# EAGLE design NeoDigito Small v2_1 PCBWay (EAGLE 9.6.2)
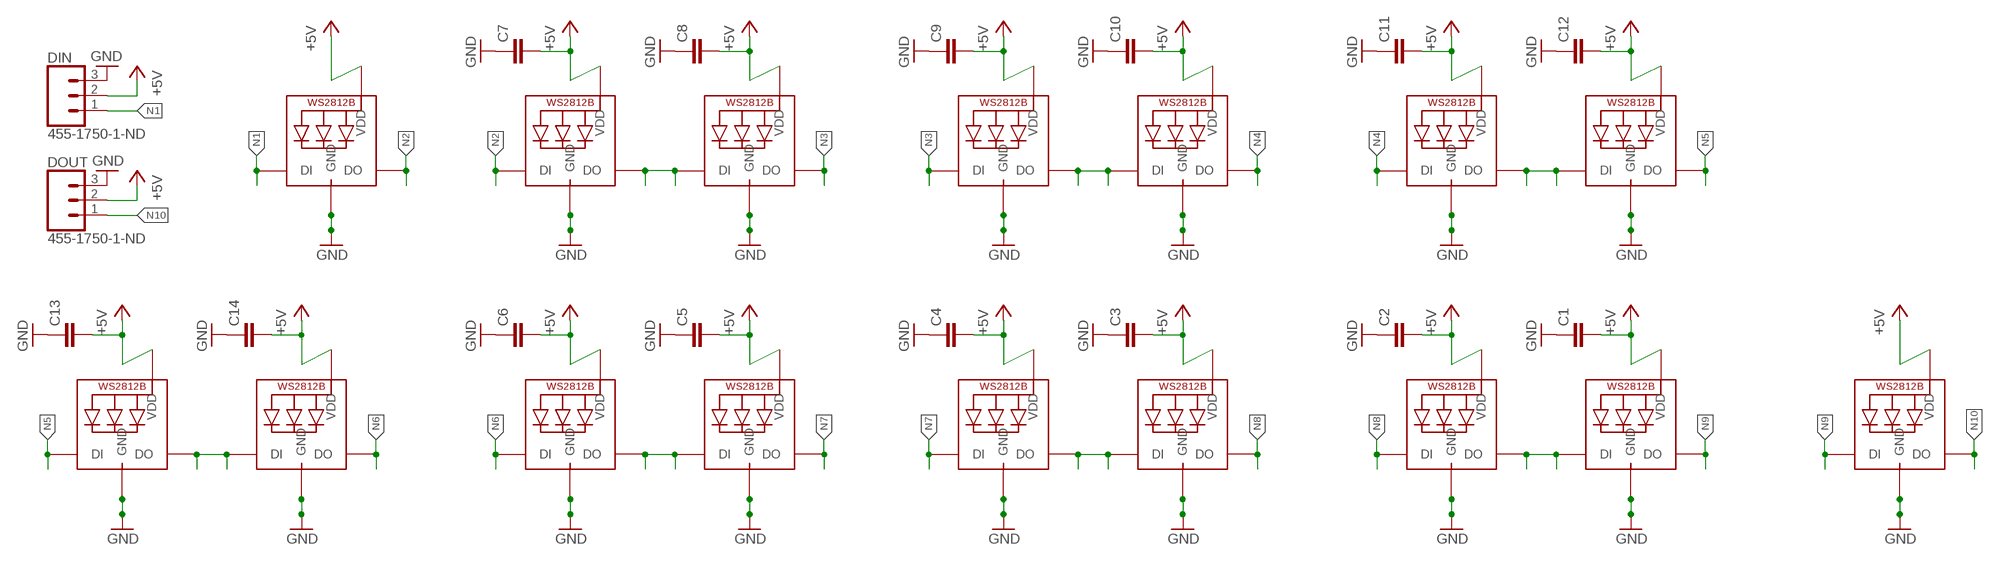
[diagram p0: schematic, sheet 1]

## Parts
C1  C-EUC0805  [C0805]
C2  C-EUC0805  [C0805]
C3  C-EUC0805  [C0805]
C4  C-EUC0805  [C0805]
C5  C-EUC0805  [C0805]
C6  C-EUC0805  [C0805]
C7  C-EUC0805  [C0805]
C8  C-EUC0805  [C0805]
C9  C-EUC0805  [C0805]
C10  C-EUC0805  [C0805]
C11  C-EUC0805  [C0805]
C12  C-EUC0805  [C0805]
C13  C-EUC0805  [C0805]
C14  C-EUC0805  [C0805]
DIN  455-1750-1-ND  CONN_03  [1X03]
DOUT  455-1750-1-ND  CONN_031X03_NO_SILK  [1X03_NO_SILK]
PA.  WS2812B3535  [LED3535]
PB.  WS2812B3535  [LED3535]
SA1.  WS2812B3535  [LED3535]
SA2.  WS2812B3535  [LED3535]
SB1.  WS2812B3535  [LED3535]
SB2.  WS2812B3535  [LED3535]
SC1.  WS2812B3535  [LED3535]
SC2.  WS2812B3535  [LED3535]
SD1.  WS2812B3535  [LED3535]
SD2.  WS2812B3535  [LED3535]
SE1.  WS2812B3535  [LED3535]
SE2.  WS2812B3535  [LED3535]
SF1.  WS2812B3535  [LED3535]
SF2.  WS2812B3535  [LED3535]
SG1.  WS2812B3535  [LED3535]
SG2.  WS2812B3535  [LED3535]

## Nets
+5V: C1.2 C2.2 C3.2 C4.2 C5.2 C6.2 C7.2 C8.2 C9.2 C10.2 C11.2 C12.2 C13.2 C14.2 DIN.2 DOUT.2 PA..2(VDD) PB..2(VDD) SA1..2(VDD) SA2..2(VDD) SB1..2(VDD) SB2..2(VDD) SC1..2(VDD) SC2..2(VDD) SD1..2(VDD) SD2..2(VDD) SE1..2(VDD) SE2..2(VDD) SF1..2(VDD) SF2..2(VDD) SG1..2(VDD) SG2..2(VDD)
GND: C1.1 C2.1 C3.1 C4.1 C5.1 C6.1 C7.1 C8.1 C9.1 C10.1 C11.1 C12.1 C13.1 C14.1 DIN.3 DOUT.3 PA..4(GND) PB..4(GND) SA1..4(GND) SA2..4(GND) SB1..4(GND) SB2..4(GND) SC1..4(GND) SC2..4(GND) SD1..4(GND) SD2..4(GND) SE1..4(GND) SE2..4(GND) SF1..4(GND) SF2..4(GND) SG1..4(GND) SG2..4(GND)
N1: DIN.1 PB..1(DI)
N2: PB..3(DO) SC1..1(DI)
N3: SC2..3(DO) SD1..1(DI)
N4: SD2..3(DO) SE1..1(DI)
N5: SE2..3(DO) SG1..1(DI)
N6: SB1..1(DI) SG2..3(DO)
N7: SA1..1(DI) SB2..3(DO)
N8: SA2..3(DO) SF1..1(DI)
N9: PA..1(DI) SF2..3(DO)
N10: DOUT.1 PA..3(DO)
N$1: SE1..3(DO) SE2..1(DI)
N$2: SC1..3(DO) SC2..1(DI)
N$3: SA1..3(DO) SA2..1(DI)
N$4: SF1..3(DO) SF2..1(DI)
N$5: SD1..3(DO) SD2..1(DI)
N$14: SG1..3(DO) SG2..1(DI)
N$17: SB1..3(DO) SB2..1(DI)

## Library data of the parts
C1-C14 = CCV1:C-EU: CAPACITOR, European symbol; SPICEPREFIX: C
DIN = CCV1:CONN_03: Multi connection point. Often used as Generic Header-pin footprint for 0.1 inch spaced/style header connections On any of the 0.1 inch spaced packages, you can populate with these: Break Away Headers - Straight <https://www.sparkfun.com/products/116> (PRT-00116) Break Away Male Headers - Right Angle <https://www.sparkfun.com/products/553> (PRT-00553) Female Headers <https://www.sparkfun.com/products/115> (PRT-00115) Break Away Headers - Machine Pin <https://www.sparkfun.com/products/117> (PRT-00117) Break Away Female Headers - Swiss Machine Pin <https://www.sparkfun.com/products/743> (PRT-00743) Stackable Header - 3 Pin (Female, 0.1") <https://www.sparkfun.com/products/13875> (PRT-13875) For SCREWTERMINALS and SPRING TERMINALS visit here: Screw Terimnals on SparkFun.com <https://www.sparkfun.com/search/results?term=Screw+Terminals> (5mm/3.5mm/2.54mm spacing) This device is also useful as a general connection point to wire up your design to another part of your project. Our various solder wires solder well into these plated through hole pads. Hook-Up Wire - Assortment (Stranded, 22 AWG) <https://www.sparkfun.com/products/11375> (PRT-11375) Hook-Up Wire - Assortment (Solid Core, 22 AWG) <https://www.sparkfun.com/products/11367> (PRT-11367) View the entire wire category on our website here <https://www.sparkfun.com/categories/141> Special notes: Molex polarized connector foot print use with SKU : PRT-08232 with associated crimp pins and housings.; PROD_ID: XXX-00000
DOUT = CCV1:CONN_03: Multi connection point. Often used as Generic Header-pin footprint for 0.1 inch spaced/style header connections On any of the 0.1 inch spaced packages, you can populate with these: Break Away Headers - Straight <https://www.sparkfun.com/products/116> (PRT-00116) Break Away Male Headers - Right Angle <https://www.sparkfun.com/products/553> (PRT-00553) Female Headers <https://www.sparkfun.com/products/115> (PRT-00115) Break Away Headers - Machine Pin <https://www.sparkfun.com/products/117> (PRT-00117) Break Away Female Headers - Swiss Machine Pin <https://www.sparkfun.com/products/743> (PRT-00743) Stackable Header - 3 Pin (Female, 0.1") <https://www.sparkfun.com/products/13875> (PRT-13875) For SCREWTERMINALS and SPRING TERMINALS visit here: Screw Terimnals on SparkFun.com <https://www.sparkfun.com/search/results?term=Screw+Terminals> (5mm/3.5mm/2.54mm spacing) This device is also useful as a general connection point to wire up your design to another part of your project. Our various solder wires solder well into these plated through hole pads. Hook-Up Wire - Assortment (Stranded, 22 AWG) <https://www.sparkfun.com/products/11375> (PRT-11375) Hook-Up Wire - Assortment (Solid Core, 22 AWG) <https://www.sparkfun.com/products/11367> (PRT-11367) View the entire wire category on our website here <https://www.sparkfun.com/categories/141> Special notes: Molex polarized connector foot print use with SKU : PRT-08232 with associated crimp pins and housings.
PA. PB. SA1. SA2. SB1. SB2. SC1. SC2. SD1. SD2. SE1. SE2. SF1. SF2. SG1. SG2. = adafruit:WS2812B

## Board
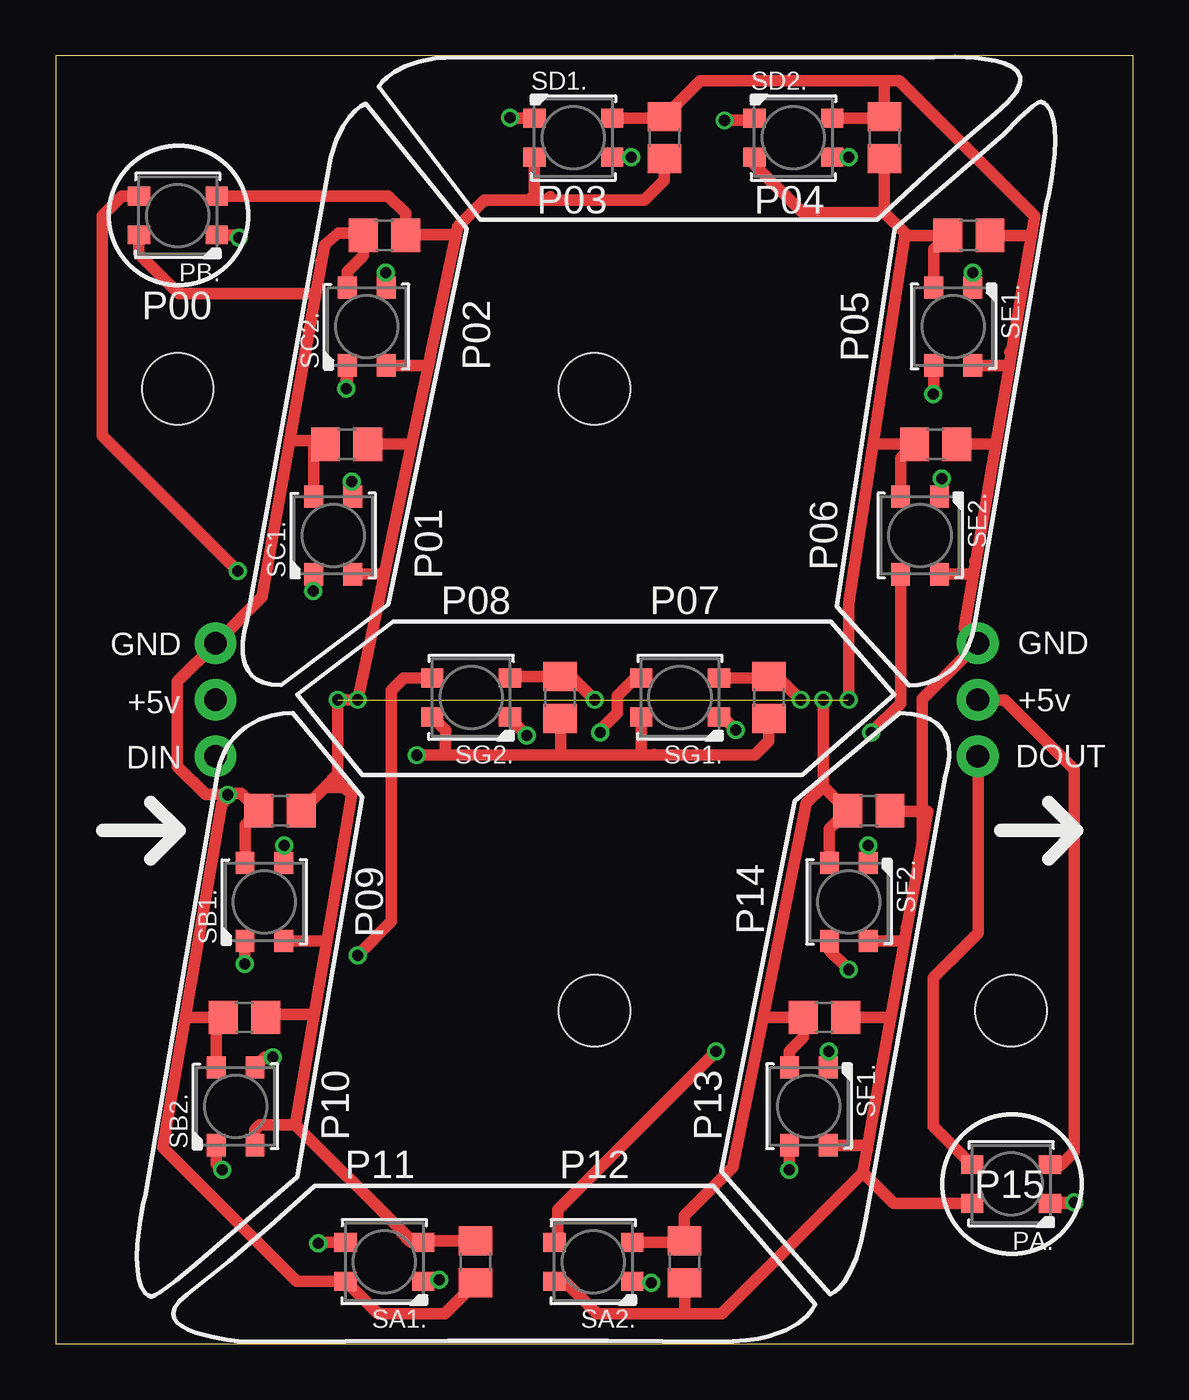
[diagram p1: board, top side]
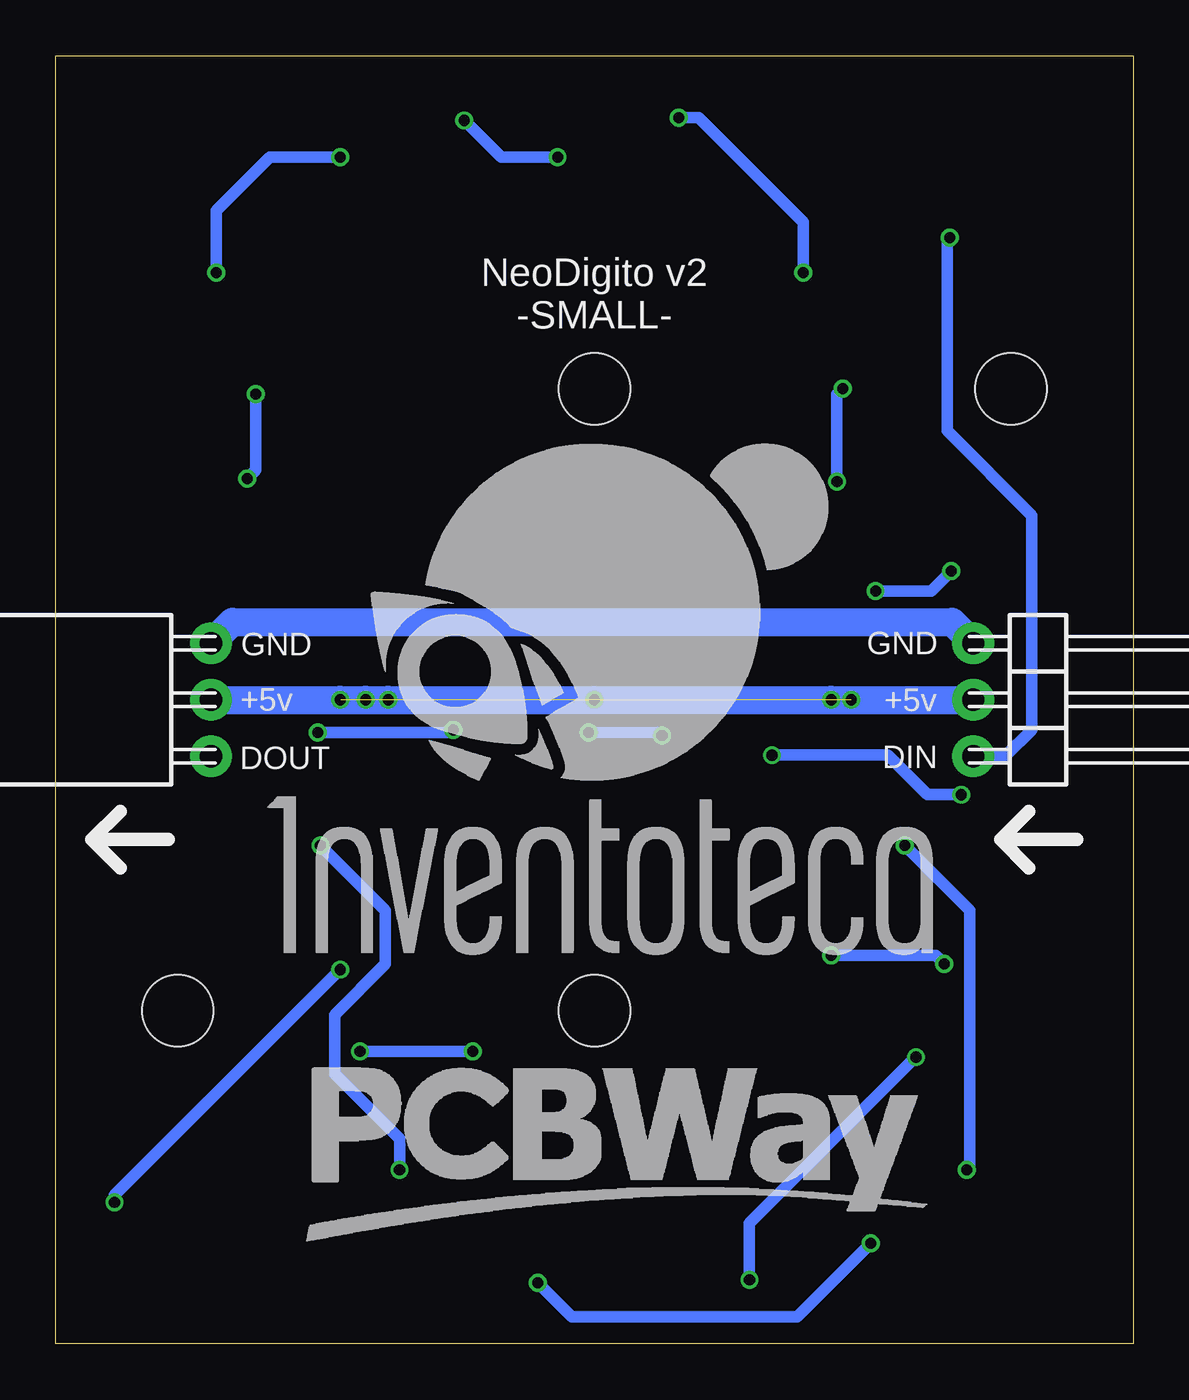
[diagram p2: board, bottom side, seen from below]

Size 48.5 x 58 mm. Coordinates in mm from the lower left corner, seen from the top.
Outline: 48.5,58 0,58 0,0 48.5,0 48.5,58
Copper layers (1*16): Top 0.035mm / dielectric 1.5mm / Bottom 0.035mm
Design rules "_xircuitos.mx_2L_DRC": minimum track width 6mil, minimum drill 12mil, track to track 6mil, track to pad 6mil, pad to pad 6mil, via to via 6mil, smd to smd 0mil, copper to edge 10mil, drill to drill 12mil, minimum pad ring 10mil, minimum via ring 6mil, stop-mask expansion 2mil, vias tented up to drill 100mil, thermal gap 10mil
Holes 3.2 mm at 24.25,43 24.25,15 43,15 5.5,43

### Footprints (pad centres in the part's own frame; a part is rotated, then mirrored left to right if it is on the bottom)
C0805 = smd 1.3 x 1.5: 1 -0.95,0; 2 0.95,0
1X03 = drill 1 pad 1.88: 1 -2.54,0; 2 0,0; 3 2.54,0
1X03_NO_SILK = drill 1.016 pad 1.88: 1 -2.54,0; 2 0,0; 3 2.54,0
LED3535 = smd 1 x 0.85: 1 -1.75,0.875; 2 -1.75,-0.875; 3 1.75,-0.875; 4 1.75,0.875

### Placement (x,y rotation side)
C1  36.6,24 180 top
C2  34.6,14.7 180 top
C3  28.3,3.7 90 top
C4  18.9,3.7 90 top
C5  8.5,14.7 0 top
C6  10.1,24 0 top
C7  13.1,40.5 0 top
C8  14.8,49.9 0 top
C9  27.4,54.3 270 top
C10  37.3,54.3 270 top
C11  41.1,49.9 180 top
C12  39.6,40.5 180 top
C13  32.1,29.1 90 top
C14  22.7,29.1 90 top
DIN  7.2,29 90 bottom
DOUT  41.5,29 90 bottom
PA.  43,7.2 180 top
PB.  5.5,50.8 180 top
SA1.  14.8,3.7 180 top
SA2.  24.2,3.7 180 top
SB1.  9.4,19.9 90 top
SB2.  8.1,10.7 90 top
SC1.  12.5,36.4 90 top
SC2.  14,45.8 90 top
SD1.  23.3,54.3 0 top
SD2.  33.2,54.3 0 top
SE1.  40.4,45.8 270 top
SE2.  38.9,36.4 270 top
SF1.  33.9,10.7 270 top
SF2.  35.7,19.9 270 top
SG1.  28.1,29.1 180 top
SG2.  18.7,29.1 180 top

### Tracks (layer width: path | path; a pad name or v marks a point on that pad's centre or on a via)
+5V  (via drill 0.5)  (1 unrouted)
  Top 0.508: 17.98,49.75 18.1,50.3 19.3,51.5 21.3,51.5 | 17.98,49.75 16.92,44.7 16.77,43.99 | 16.77,43.99 16.02,40.43 | 16.02,40.43 14.95,35.41 14.79,34.62 | 14.79,34.62 v13.6,29 v12.7,29 12.7,25.65 | C7.2 15.95,40.5 16.02,40.43 | 17.98,49.75 17.98,49.9 18.02,49.94 15.79,49.94 C8.2 15.75,50.9 14.97,51.67 PB..2 | C9.2 27.4,52.4 26.5,51.5 22.1,51.5 | 21.3,51.5 22.1,51.5 | 22.25,51.65 22.1,51.5 | 36.77,40.43 35.69,33.36 v35.69,29 | 36.77,40.43 38.23,50 | 38.23,50 37.3,50.93 | 37.3,50.93 C10.2 | 37.3,50.93 33.62,50.93 31.45,53.09 SD2..2 | 38.23,50 38.33,49.9 C11.2 39.52,49.27 SE1..2 | 36.77,40.43 36.84,40.5 C12.2 38.02,39.88 SE2..2 | v33.53,29 32.48,30.05 C13.2 32.02,29.98 SG1..2 | v24.26,29 23.21,30.05 C14.2 20.7,30.05 20.62,29.98 SG2..2 | v34.55,29 34.55,25.11 | 34.55,25.11 33.78,24.34 31.82,14.6 | 31.82,14.6 30.48,7.96 28.3,5.78 C3.2 28.23,4.58 SA2..2 | 15.93,4.65 C4.2 | 12.7,25.65 12.7,25.36 13,25.06 | 13,25.06 13.34,24.73 12.36,19 12.2,18.1 | 12.2,18.1 11.64,14.83 | 11.64,14.83 10.8,9.87 | 10.8,9.87 15.53,5.13 | 15.53,5.13 15.85,4.81 | 10.8,9.87 9.19,9.87 8.97,9.65 SB2..2 | C5.2 9.58,14.83 11.64,14.83 | C6.2 12.11,25.06 | 12.11,25.06 12.7,25.65 | 13,25.06 12.11,25.06 | 31.82,14.6 31.92,14.7 C2.2 33.66,13.8 33.02,13.17 SF1..2 | 34.55,25.11 34.55,25.1 C1.2 34.83,23.18 SF2..2 | DOUT.2 42.72,29 45.85,25.87 45.85,8.66 45.26,8.07 PA..2 | SC1..2 14.76,34.65 14.79,34.62 | SC2..2 16.7,44.05 16.77,43.99 | SD1..2 21.55,51.75 21.3,51.5 | SB1..2 12.15,18.15 12.2,18.1 | SA1..2 16,4.58 15.93,4.65 | 15.53,5.13 15.53,5.04 15.93,4.65
  Bottom 0.508: 34.42,29 v34.55,29
  Bottom 1.27: DOUT.2 v35.69,29 v34.55,29 v33.53,29 v24.26,29 v13.6,29 DIN.2
GND  (via drill 0.5)
  Top 0.508: 11.62,39.98 C7.1 11.99,40.66 11.5,40.66 | 10.54,40.66 9.3,33.7 9.3,33.64 DIN.3 5.48,29.82 5.48,26 6.75,24.73 v7.75,24.73 7.88,24.73 | 10.54,40.66 11.71,47.28 | 11.93,48.49 12.11,49.48 12.73,50 13.75,50 C8.1 13.85,49 13.12,48.27 SC2..4 | 11.71,47.28 5.55,47.28 3.75,49.08 PB..4 | 11.93,48.74 11.93,48.49 | 11.5,40.66 10.54,40.66 | 41.3,34.58 40.9,32.22 DOUT.3 38.99,29.03 38.99,22.55 | 41.3,34.58 41.41,35.2 | 41.41,35.2 42.31,40.47 | 42.31,40.47 42.91,43.98 | 42.91,43.98 43.01,44.57 | 43.01,44.57 43.92,49.85 | 43.92,49.85 44.07,50.76 37.98,56.86 37.47,56.86 | 37.47,56.86 29.01,56.86 C9.1 27.32,55.17 SD1..4 | 37.47,56.86 37.3,56.69 C10.1 37.23,55.17 SD2..4 | C11.1 43.87,49.9 43.92,49.85 | 42.93,44.65 43.01,44.57 | C12.1 42.28,40.5 42.31,40.47 | 41.36,35.25 41.41,35.2 | 26.93,26.5 31.47,26.5 32.1,27.13 C13.1 | 26.93,26.5 26.3,26.5 | 26.3,26.5 22.73,26.5 | 22.73,26.5 17.66,26.5 | C14.1 22.73,28.11 22.73,26.5 | 26.95,26.53 26.93,26.5 | 7.88,24.73 7.47,24.32 5.83,14.7 | 5.83,14.7 4.83,8.85 10.85,2.83 SA1..4 14.52,1.36 17.51,1.36 C4.1 | 38.99,22.55 38.3,18.72 | 38.3,18.72 38.21,18.18 | 38.21,18.18 37.56,14.57 | 37.56,14.57 36.64,9.47 36.56,9.04 | 36.56,9.04 36.32,7.71 | 36.32,7.71 29.97,1.36 28.32,1.36 | 28.32,1.36 24.39,1.36 22.92,2.83 SA2..4 | C3.1 28.32,2.73 28.32,1.36 | C1.1 37.59,23.96 39.24,23.96 38.99,22.55 | C2.1 37.43,14.7 37.56,14.57 | 38.27,18.75 38.3,18.72 | 5.83,14.7 C5.1 7.22,14.38 SB2..4 | 17.66,26.5 v16.26,26.5 | 17.66,26.5 17.53,26.63 17.53,27.14 17.55,27.16 17.55,27.62 SG2..4 | 7.88,24.73 7.94,24.79 8.36,24.79 C6.1 8.53,23.38 SB1..4 | SC1..4 11.62,40.53 11.5,40.66 | SE2..4 41.23,34.65 41.3,34.58 | SE1..4 42.84,44.05 42.91,43.98
  Top 0.508: SG1..4 26.35,26.55 26.3,26.5 | SF1..4 36.47,8.95 36.56,9.04 | SF2..4 38.17,18.15 38.21,18.18 | PA..4 37.72,6.33 36.33,7.71 36.32,7.71 | 11.71,47.28 11.93,48.49
  Bottom 0.508: v16.26,26.5 11.05,26.5 9.27,24.73 v7.75,24.73
  Bottom 1.27: DOUT.3 40.54,32.5 8.16,32.5 DIN.3
N1  (via drill 0.5)
  Top 0.508: v8.26,49.81 8.14,49.92 PB..1
  Bottom 0.508: DIN.1 5.76,26.46 4.57,27.65 4.57,37.3 8.38,41.11 8.38,49.68 v8.26,49.81
N2  (via drill 0.5)
  Top 0.508: v8.2,34.8 2.1,40.9 2.1,50.8 2.98,51.67 PB..3 | 11.6,34.88 v11.6,33.9 11.6,34.62 SC1..1
  Bottom 0.508: v8.2,34.8 9.1,33.9 v11.6,33.9
N3  (via drill 0.5)
  Top 0.508: v14.86,48.22 14.88,48.21 SC2..3 | SD1..1 20.48,55.17 v20.45,55.21
  Bottom 0.508: v14.86,48.22 14.86,50.51 19.56,55.21 v20.45,55.21
N4  (via drill 0.5)
  Top 0.508: v41.28,48.22 v41.27,48.22 SE1..1 | v35.69,53.43 v35.69,53.42 SD2..3
  Bottom 0.508: v35.69,53.43 38.86,53.43 41.28,51.02 v41.28,48.22
N5  (via drill 0.5)
  Top 0.508: SE2..3 38.02,28.84 v36.7,27.52 | v30.61,27.65 30.03,28.23 SG1..1
  Bottom 0.508: v36.7,27.52 30.74,27.52 v30.61,27.65
N6  (via drill 0.5)
  Top 0.508: SG2..3 15.66,29.98 15.12,29.43 15.12,19.01 v13.59,17.49 | 8.53,17.12 v8.51,17.11 8.51,18.14 SB1..1
  Bottom 0.508: v13.59,17.49 8.89,17.49 v8.51,17.11
N7  (via drill 0.5)
  Top 0.508: v9.78,12.91 9.44,12.91 SB2..3 | v17.27,2.88 16.36,2.88 16.41,2.83 SA1..1
  Bottom 0.508: v9.78,12.91 17.27,5.42 v17.27,2.88
N8  (via drill 0.5)
  Top 0.508: v29.72,13.17 22.6,6.05 22.6,4.7 22.48,4.58 SA2..3 | v34.8,13.17 34.77,13.14 SF1..1
  Bottom 0.508: v29.72,13.17 v34.8,13.17
N9  (via drill 0.5)
  Top 0.508: v35.69,16.85 34.83,17.72 SF2..3 | 45.1,6.37 v45.85,6.37 45.8,6.33 PA..1 44.8,6.37
  Bottom 0.508: v35.69,16.85 45.85,6.69 v45.85,6.37
N10
  Top 0.508: DOUT.1 41.53,26.43 41.53,18.5 39.5,16.47 39.5,9.79 41.23,8.05 PA..3
N$1  (via drill 0.5)
  Top 0.508: v39.5,42.76 39.52,42.79 SE1..3 | 39.77,38.84 v39.88,38.95 39.88,38.26 SE2..1
  Bottom 0.508: v39.5,42.76 39.5,39.33 v39.88,38.95
N$2  (via drill 0.5)
  Top 0.508: 13.08,44.26 v13.08,43.01 13.12,43.06 SC2..1 | 13.34,38.04 13.34,38.4 | 13.34,38.4 v13.34,38.82 | SC1..3 13.38,38.36 13.34,38.4
  Bottom 0.508: v13.34,38.82 13.34,42.76 v13.08,43.01
N$3  (via drill 0.5)
  Top 0.508: v11.81,4.53 11.86,4.58 SA1..3 | 26.73,2.83 v26.8,2.75 26.02,2.75 SA2..1
  Bottom 0.508: v11.81,4.53 15.12,1.23 25.27,1.23 v26.8,2.75
N$4  (via drill 0.5)
  Top 0.508: SF1..3 v33.02,7.83 | SF2..1 v36.58,22.44
  Bottom 0.508: v33.02,7.83 33.02,9.23 35.94,12.15 35.94,14.82 33.66,17.11 33.66,19.52 v36.58,22.44
N$5  (via drill 0.5)
  Top 0.508: 24.9,53.43 v25.91,53.43 v25.91,53.42 SD1..3 | v30.1,55.08 31.6,55.08 31.51,55.17 SD2..1
  Bottom 0.508: v30.1,55.08 28.45,53.43 v25.91,53.43
N$14  (via drill 0.5)
  Top 0.508: v24.51,27.52 24.51,27.65 25.27,28.41 25.27,29.17 26.08,29.98 SG1..3 | v21.21,27.39 20.38,28.23 SG2..1
  Bottom 0.508: v24.51,27.52 21.34,27.52 v21.21,27.39
N$17  (via drill 0.5)
  Top 0.508: 10.28,22.43 v10.29,22.44 10.29,21.66 SB1..3 | v7.5,7.83 7.22,8.11 SB2..1
  Bottom 0.508: v10.29,22.44 7.37,19.52 7.37,7.96 v7.5,7.83

### Text on the board
tPlace: P03 | P04 | P00 | P05 | P02 | P01 | P06 | P08 | P07 | GND | GND | +5v | +5v | DIN | DOUT | P09 | P14 | P10 | P13 | P11 | P12 | P15
bPlace: NeoDigito v2 / -SMALL- | GND | GND | +5v | +5v